# EAGLE design HC-SR04 Shield (EAGLE 7.6.0)
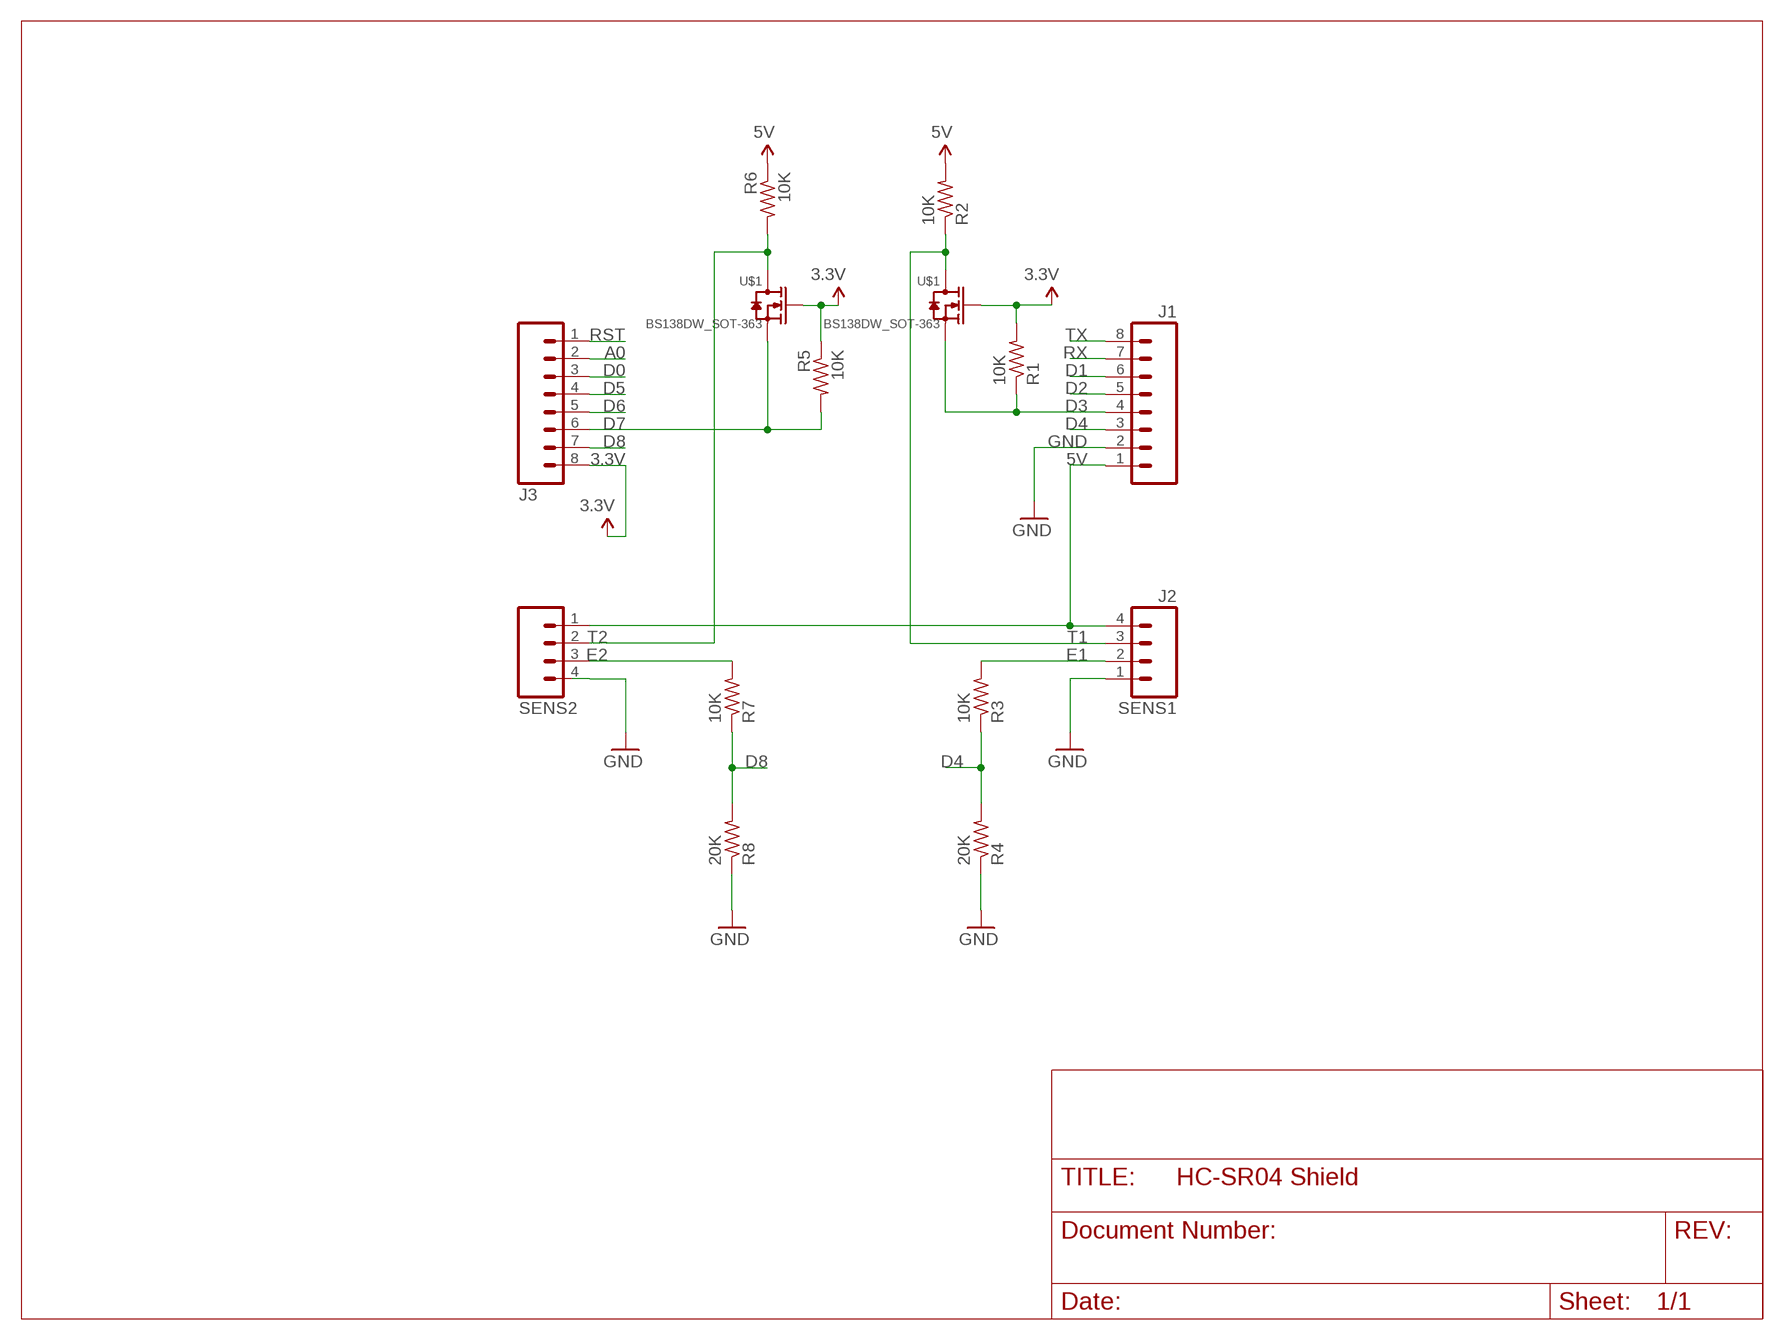
[diagram p0: schematic, sheet 1]

## Parts
J1  M08SILK_FEMALE_PTH  [1X08]
J2  SENS1  M04PTH  [1X04]
J3  M08SILK_FEMALE_PTH  [1X08]
R1  10K  R-US_R0805  [R0805]
R2  10K  R-US_R0805  [R0805]
R3  10K  R-US_R0805  [R0805]
R4  20K  R-US_R0805  [R0805]
R5  10K  R-US_R0805  [R0805]
R6  10K  R-US_R0805  [R0805]
R7  10K  R-US_R0805  [R0805]
R8  20K  R-US_R0805  [R0805]
SENS2  M04JST-PTH-VERT  [JST-4-PTH-VERT]
U$1  BS138DW_SOT-363  [SOT363]

## Nets
3.3V: J3.8 R1.2 R5.1 U$1.2(G1) U$1.5(G)
5V: J1.1 J2.4 R2.2 R6.1 SENS2.1
A0: J3.2
D0: J3.3
D1: J1.6
D2: J1.5
D3: J1.4 R1.1 U$1.4(S)
D4: J1.3 R3.1 R4.2
D5: J3.4
D6: J3.5
D7: J3.6 R5.2 U$1.1(S1)
D8: J3.7 R7.1 R8.2
E1: J2.2 R3.2
E2: R7.2 SENS2.3
GND: J1.2 J2.1 R4.1 R8.1 SENS2.4
RST: J3.1
RX: J1.7
T1: J2.3 R2.1 U$1.3(D)
T2: R6.2 SENS2.2 U$1.6(D1)
TX: J1.8

## Library data of the parts
J1 J3 = SparkFun-Connectors:M08: Header 8 Standard 8-pin 0.1" header. Use with straight break away headers (SKU : PRT-00116), right angle break away headers (PRT-00553), swiss pins (PRT-00743), machine pins (PRT-00117), and female headers (PRT-00115).; PROD_ID: CONN-08438
J2 = SparkFun-Connectors:M04: Header 4 Standard 4-pin 0.1" header. Use with straight break away headers (SKU : PRT-00116), right angle break away headers (PRT-00553), swiss pins (PRT-00743), machine pins (PRT-00117), and female headers (PRT-00115). Molex polarized connector foot print use with SKU : PRT-08231 with associated crimp pins and housings. 1MM SMD Version SKU: PRT-10208; PROD_ID: CONN-09696
R1-R8 = resistor:R-US_: RESISTOR, American symbol
SENS2 = SparkFun-Connectors:M04: Header 4 Standard 4-pin 0.1" header. Use with straight break away headers (SKU : PRT-00116), right angle break away headers (PRT-00553), swiss pins (PRT-00743), machine pins (PRT-00117), and female headers (PRT-00115). Molex polarized connector foot print use with SKU : PRT-08231 with associated crimp pins and housings. 1MM SMD Version SKU: PRT-10208
U$1 = AaronJasso:BS138DW_SOT-363

## Board
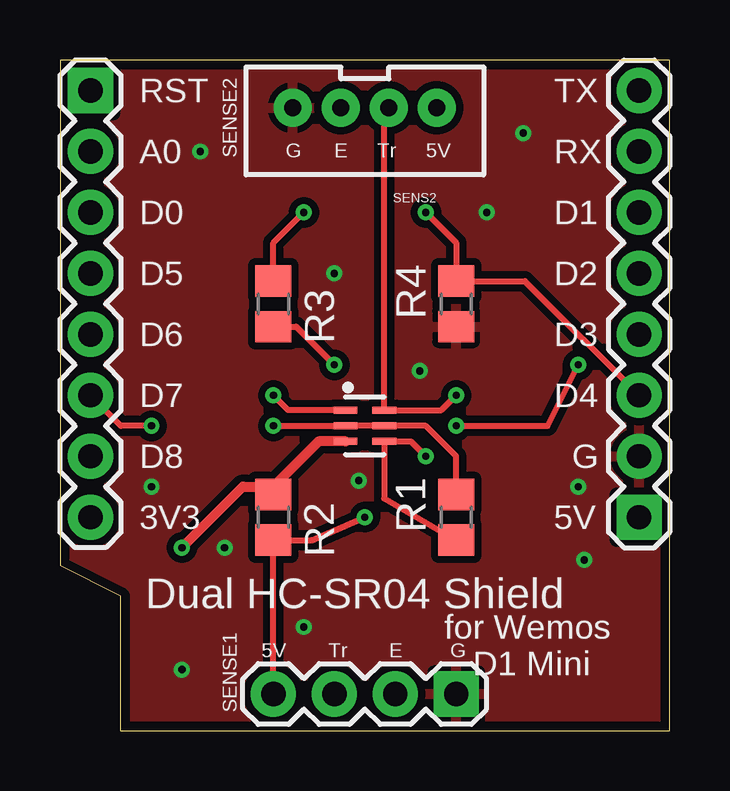
[diagram p1: board, top side]
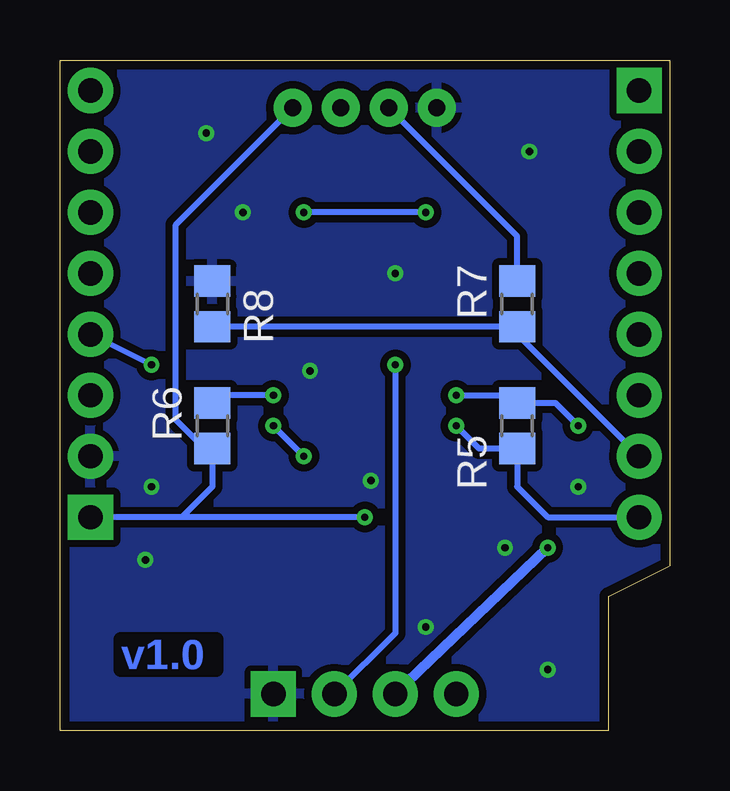
[diagram p2: board, bottom side, seen from below]

Size 25.4 x 27.94 mm. Coordinates in mm from the lower left corner, seen from the top.
Outline: 2.54,0 25.4,0 25.4,27.94 0,27.93 0,6.86 2.54,5.59 2.54,0
Copper layers (1*16): Top 0.0356mm / dielectric 1.5011mm / Bottom 0.0356mm
Design rules "LaenPCBOrder *": minimum track width 6mil, minimum drill 13mil, track to track 6mil, track to pad 6mil, pad to pad 6mil, via to via 6mil, smd to smd 6mil, copper to edge 15mil, drill to drill 6mil, minimum pad ring 7mil, minimum via ring 7mil, stop-mask expansion 3mil, vias tented up to drill 15mil, thermal gap 10mil

### Footprints (pad centres in the part's own frame; a part is rotated, then mirrored left to right if it is on the bottom)
1X08 = drill 1.016 pad 1.88 square: 1 0,0 | drill 1.016 pad 1.88: 2 2.54,0; 3 5.08,0; 4 7.62,0; 5 10.16,0; 6 12.7,0; 7 15.24,0; 8 17.78,0
1X04 = drill 1.016 pad 1.88 square: 1 0,0 | drill 1.016 pad 1.88: 2 2.54,0; 3 5.08,0; 4 7.62,0
R0805 = smd 1.3 x 1.5: 1 -0.95,0; 2 0.95,0
JST-4-PTH-VERT = drill 0.7 pad 1.6: 1 -3,-0.55; 2 -1,-0.55; 3 1,-0.55; 4 3,-0.55
SOT363 = smd 0.3 x 0.99: 1 -0.65,-0.8; 2 0,-0.8; 3 0.65,-0.8; 4 0.65,0.81; 5 0,0.81; 6 -0.65,0.81

### Placement (x,y rotation side)
J1  24.13,8.89 90 top
J2  16.51,1.52 180 top
J3  1.27,26.67 270 top
R1  16.51,8.89 90 top
R2  8.89,8.89 270 top
R3  8.89,17.78 270 top
R4  16.51,17.78 90 top
R5  6.35,12.7 90 bottom
R6  19.05,12.7 90 bottom
R7  6.35,17.78 90 bottom
R8  19.05,17.78 270 bottom
SENS2  12.7,25.4 180 top
U$1  12.7,12.7 270 top

### Tracks (layer width: path | path; a pad name or v marks a point on that pad's centre or on a via)
3.3V  (via drill 0.3)
  Top 0.254: R1.2 16.51,11.43 15.24,12.7 U$1.5 U$1.2 v8.89,12.7
  Bottom 0.254: J3.8 5.08,8.89 6.35,10.16 R5.1 7.94,11.75 v8.89,12.7
5V  (via drill 0.3)
  Top 0.254: J2.4 R2.2 10.48,7.94 v12.7,8.89
  Bottom 0.254: 20.32,8.89 19.05,10.16 R6.1 19.37,11.75 20.57,12.95 20.57,21.08 SENS2.1 | 20.32,8.89 J1.1 | v12.7,8.89 20.32,8.89
D3  (via drill 0.3)
  Top 0.254: R1.1 13.51,9.67 U$1.4 14.62,12.05 v15.24,11.43 | v16.51,12.7 20.32,12.7 v21.59,15.24
  Bottom 0.254: v15.24,11.43 v16.51,12.7 | v21.59,15.24 J1.4
D4  (via drill 0.3)
  Top 0.254: R3.1 8.89,20.32 v10.16,21.59 | v15.24,21.59 16.51,20.32 R4.2 19.37,18.73 J1.3
  Bottom 0.254: v10.16,21.59 v15.24,21.59
D7  (via drill 0.3)
  Top 0.254: v3.81,12.7 2.54,12.7 J3.6 | U$1.1 9.51,13.35 v8.89,13.97
  Bottom 0.254: v3.81,12.7 4.76,13.65 R5.2 6.67,13.97 v8.89,13.97
D8
  Bottom 0.254: J3.7 6.35,16.51 R7.1 R8.2
E1  (via drill 0.3)
  Top 0.254: R3.2 9.84,16.83 v11.43,15.24
  Bottom 0.254: v11.43,15.24 11.43,4.06 J2.2
E2
  Bottom 0.254: R7.2 6.35,20.6 SENS2.3
GND  (via drill 0.3)
  other vias: 21.59,10.16 19.3,24.89 5.08,2.54 14.99,14.99 3.81,10.16 17.78,21.59 11.43,19.05 5.84,24.13 21.84,7.11 10.16,4.32 12.45,10.41 6.86,7.62
  pour Top (isolate 0.305): -2.54,0 -2.54,30.48 27.94,30.48 27.94,-2.54 -2.54,-2.54
  pour Bottom (isolate 0.305): -2.54,-2.54 -2.54,30.48 27.94,30.48 27.94,-2.54
T1  (via drill 0.3)
  Top 0.406: v5.08,7.62 7.62,10.16 8.57,10.16 R2.1 8.89,10.16 10.78,12.05 U$1.3
  Bottom 0.406: J2.3 v5.08,7.62
T2  (via drill 0.3)
  Top 0.254: SENS2.2 13.51,25.76 U$1.6 15.89,13.35 v16.51,13.97
  Bottom 0.254: v16.51,13.97 18.73,13.97 R6.2

### Text on the board
Bottom: v1.0
tPlace: RST | TX | A0 | SENSE2 | G | E | Tr | 5V | RX | D0 | D1 | D5 | D2 | D6 | D3 | D7 | D4 | D8 | G | 3V3 | 5V | Dual HC-SR04 Shield | 5V | Tr | E | G | for Wemos / D1 Mini | SENSE1